# Altium schematic sheet LCD.SchDoc
size A4; Author: Induja N/Karthik R; SheetNumber: 4; SheetTotal: 7
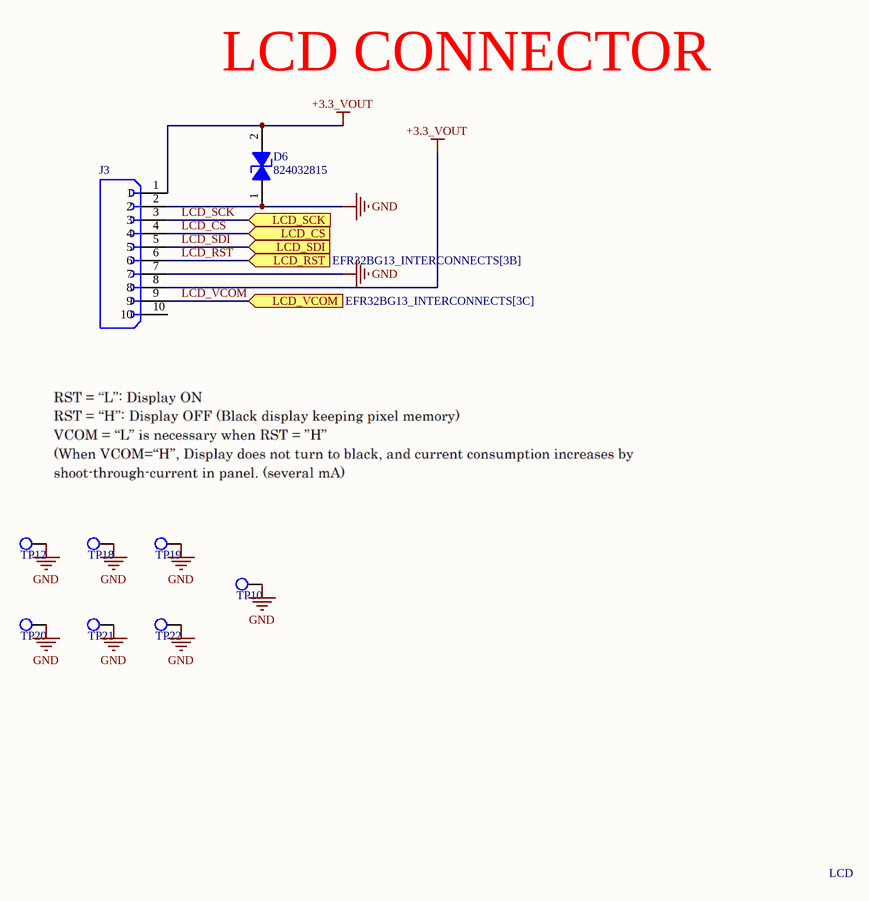
[diagram p0: LCD.SchDoc]

## Parts
D6  824032815  [WE-TVS_DFN1610-2L]
J3  (no value)  [HRS_TF13BA-10S-0.4SH(800)]
TP10  (no value)  [Test Point]  (net tie, no BOM)
TP12  (no value)  [Test Point]  (net tie, no BOM)
TP18  (no value)  [Test Point]  (net tie, no BOM)
TP19  (no value)  [Test Point]  (net tie, no BOM)
TP20  (no value)  [Test Point]  (net tie, no BOM)
TP21  (no value)  [Test Point]  (net tie, no BOM)
TP22  (no value)  [Test Point]  (net tie, no BOM)

## Ports
LCD_CS (in, see EFR32BG13_INTERCONNECTS[3B]), LCD_RST (in, see EFR32BG13_INTERCONNECTS[3B]), LCD_SCK (in, see EFR32BG13_INTERCONNECTS[3B]), LCD_SDI (in, see EFR32BG13_INTERCONNECTS[3B]), LCD_VCOM (in, see EFR32BG13_INTERCONNECTS[3C])

## Nets
+3.3_VOUT: D6.2(GND) J3.1 J3.8
GND: D6.1(I/O_1) J3.2 J3.7 TP10.1 TP12.1 TP18.1 TP19.1 TP20.1 TP21.1 TP22.1
LCD_CS: J3.4 ; port LCD_CS
LCD_RST: J3.6 ; port LCD_RST
LCD_SCK: J3.3 ; port LCD_SCK
LCD_SDI: J3.5 ; port LCD_SDI
LCD_VCOM: J3.9 ; port LCD_VCOM

Not connected (* = marked no-connect by the designer): J3 10

## Notes on the sheet
- LCD CONNECTOR
- LCD

## Library data of the parts
D6 = TVS Diode ESD Protection: 824032815 Tvs Diode, Bidir, 5V, Dfn1610 Rohs Compliant: Yes |Wurth Elektronik 824032815; NexarPartId: 133963841; Min Operating Temperature: -55°C; Width: 1mm; Length: 1.6mm; RoHS: Compliant; Max Operating Temperature: 85°C; Height: 500µm; Supplier 1: DigiKey; Supplier Part Number 1: 732-824032815CT-ND
J3 = TF13BA-10S-0.4SH(800): MP: TF13BA-10S-0.4SH(800); Value: *; Availability: Unavailable; Package: None; Price: None
TP10 TP12 TP18-TP22 = Test Point